# EAGLE schematic bat_mini5 (EAGLE 9.0.1)
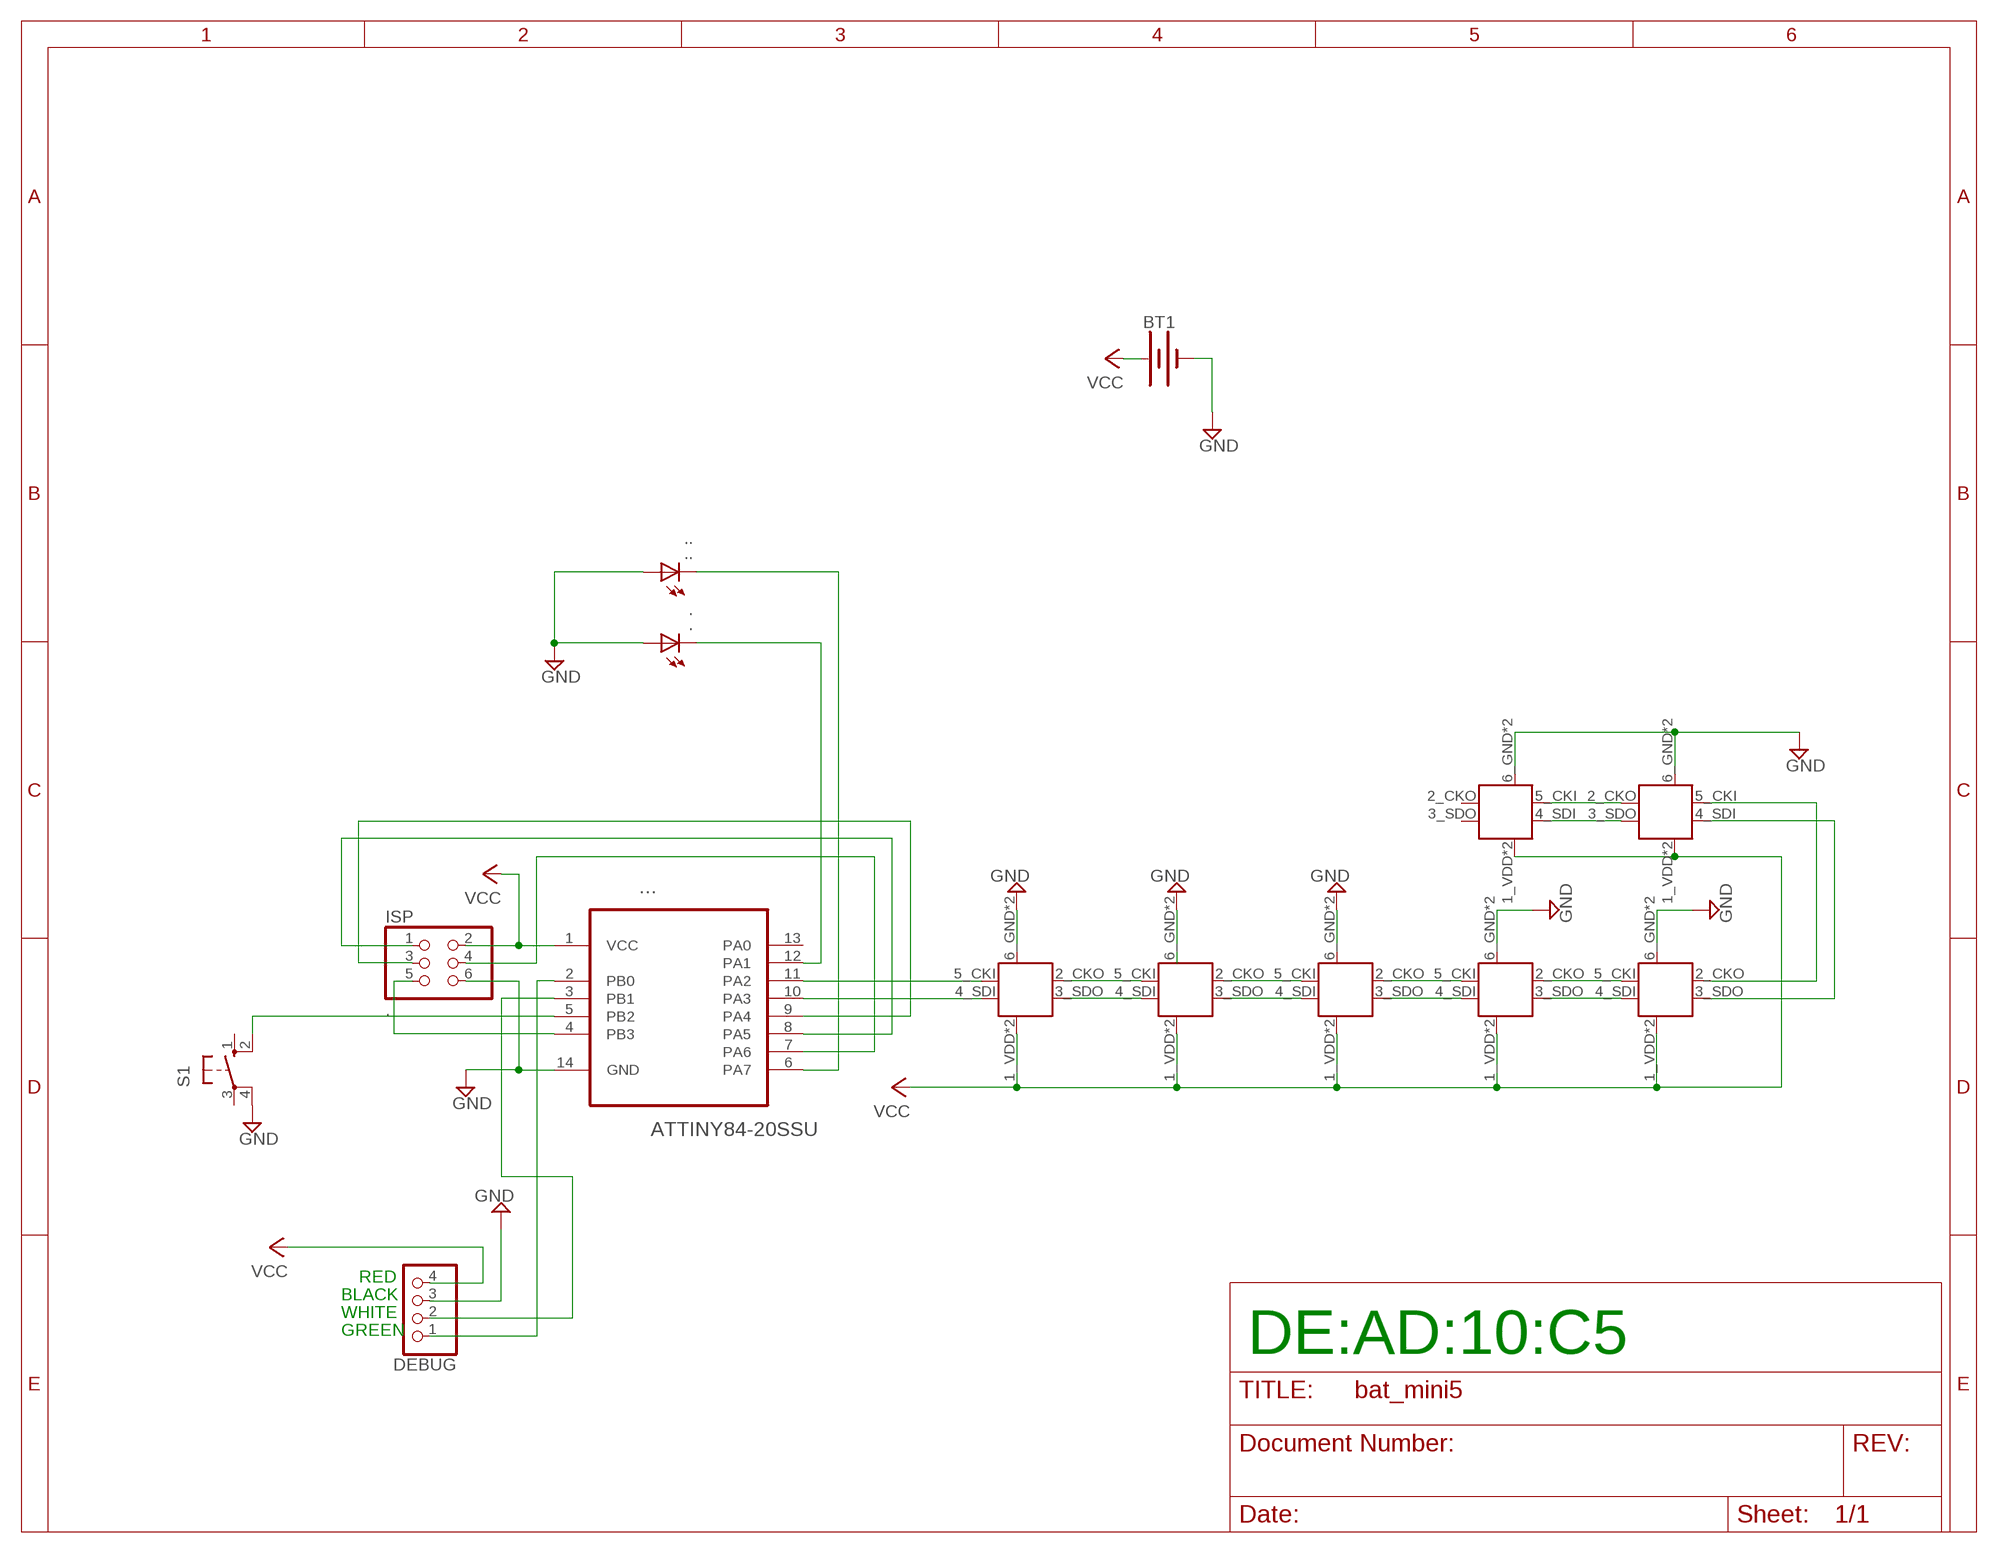
[diagram p0: schematic, sheet 1]

## Parts
.  .  LEDCHIP-LED0805  [CHIP-LED0805]
..  ..  LEDCHIP-LED0805  [CHIP-LED0805]
...  ATTINY84-20SSU  [SOIC127P600X175-14N]
BT1  BATTERY-20MM_SMD_4LEGS  [BATTCON_20MM_4LEGS]
DEBUG  PINHD-1X4  [1X04]
ISP  .  PINHD-2X3  [2X03]
ONE  APA102  [APA102-2020]
S1  10-XX  [B3F-10XX]
THREE  APA102  [APA102-2020]
TWO  APA102  [APA102-2020]
U$5  APA102  [APA102-2020]
U$6  APA102  [APA102-2020]
U$7  APA102  [APA102-2020]
U$8  APA102  [APA102-2020]

## Nets
GND: ....14(GND) ...A ..A BT1.NEGATIVE(-) DEBUG.3 ISP.6 ONE.6_GND(GND) ONE.GNDPAD(GND) S1.4(P1) U$5.6_GND(GND) U$5.GNDPAD(GND) U$6.6_GND(GND) U$6.GNDPAD(GND) U$8.6_GND(GND) U$8.GNDPAD(GND)
N$1: ....2(PB0) DEBUG.1
N$3: ....8(PA5) ISP.1
N$4: ....7(PA6) ISP.4
N$5: ....9(PA4) ISP.3
N$6: ....4(PB3) ISP.5
N$7: ....12(PA1) ..C
N$8: ....6(PA7) ...C
N$9: ....11(PA2) ONE.5_CKI(CKI)
N$10: ....10(PA3) ONE.4_SDI(SDI)
N$11: ONE.3_SDO(SDO) TWO.4_SDI(SDI)
N$12: ONE.2_CKO(CKO) TWO.5_CKI(CKI)
N$13: THREE.4_SDI(SDI) TWO.3_SDO(SDO)
N$14: THREE.5_CKI(CKI) TWO.2_CKO(CKO)
N$15: ....3(PB1) DEBUG.2
N$16: THREE.3_SDO(SDO) U$5.4_SDI(SDI)
N$17: THREE.2_CKO(CKO) U$5.5_CKI(CKI)
N$18: U$5.3_SDO(SDO) U$6.4_SDI(SDI)
N$19: U$5.2_CKO(CKO) U$6.5_CKI(CKI)
N$20: U$6.2_CKO(CKO) U$7.5_CKI(CKI)
N$21: U$6.3_SDO(SDO) U$7.4_SDI(SDI)
N$22: U$7.3_SDO(SDO) U$8.4_SDI(SDI)
N$23: U$7.2_CKO(CKO) U$8.5_CKI(CKI)
N$24: ....5(PB2) S1.2(S1)
VCC: ....1(VCC) BT1.POSITIVE@1(+) BT1.POSITIVE@2(+) BT1.POSITIVE@3(+) BT1.POSITIVE@4(+) DEBUG.4 ISP.2 ONE.1_VDD(VCC) ONE.VDDPAD(VCC) THREE.1_VDD(VCC) THREE.VDDPAD(VCC) TWO.1_VDD(VCC) TWO.VDDPAD(VCC) U$5.1_VDD(VCC) U$5.VDDPAD(VCC) U$6.1_VDD(VCC) U$6.VDDPAD(VCC) U$7.1_VDD(VCC) U$7.VDDPAD(VCC) U$8.1_VDD(VCC) U$8.VDDPAD(VCC)
Unconnected: ....13(PA0) S1.1(S) S1.3(P) U$8.2_CKO(CKO) U$8.3_SDO(SDO)

## Notes on the sheet
- RED
- BLACK
- WHITE
- GREEN
- DE:AD:10:C5

## Power pins joined to a net without a drawn wire
GND: THREE.6_GND(GND) THREE.GNDPAD(GND) TWO.6_GND(GND) TWO.GNDPAD(GND) U$7.6_GND(GND) U$7.GNDPAD(GND)

## Library data of the parts
. .. = led:LED: LED OSRAM: - CHIPLED LG R971, LG N971, LY N971, LG Q971, LY Q971, LO R971, LY R971 LH N974, LH R974 LS Q976, LO Q976, LY Q976 LO Q996 - Hyper CHIPLED LW Q18S LB Q993, LB Q99A, LB R99A - SideLED LS A670, LO A670, LY A670, LG A670, LP A670 LB A673, LV A673, LT A673, LW A673 LH A674 LY A675 LS A676, LA A676, LO A676, LY A676, LW A676 LS A679, LY A679, LG A679 - Hyper Micro SIDELED® LS Y876, LA Y876, LO Y876, LY Y876 LT Y87S - SmartLED LW L88C, LW L88S LB L89C, LB L89S, LG L890 LS L89K, LO L89K, LY L89K LS L896, LA L896, LO L896, LY L896 - TOPLED LS T670, LO T670, LY T670, LG T670, LP T670 LSG T670, LSP T670, LSY T670, LOP T670, LYG T670 LG T671, LOG T671, LSG T671 LB T673, LV T673, LT T673, LW T673 LH T674 LS T676, LA T676, LO T676, LY T676, LB T676, LH T676, LSB T676, LW T676 LB T67C, LV T67C, LT T67C, LS T67K, LO T67K, LY T67K, LW E67C LS E67B, LA E67B, LO E67B, LY E67B, LB E67C, LV E67C, LT E67C LW T67C LS T679, LY T679, LG T679 LS T770, LO T770, LY T770, LG T770, LP T770 LB T773, LV T773, LT T773, LW T773 LH T774 LS E675, LA E675, LY E675, LS T675 LS T776, LA T776, LO T776, LY T776, LB T776 LHGB T686 LT T68C, LB T68C - Hyper Mini TOPLED® LB M676 - Mini TOPLED Santana® LG M470 LS M47K, LO M47K, LY M47K Source: http://www.osram.convergy.de LUXEON: - LUMILED® LXK2-PW12-R00, LXK2-PW12-S00, LXK2-PW14-U00, LXK2-PW14-V00 LXK2-PM12-R00, LXK2-PM12-S00, LXK2-PM14-U00 LXK2-PE12-Q00, LXK2-PE12-R00, LXK2-PE12-S00, LXK2-PE14-T00, LXK2-PE14-U00 LXK2-PB12-K00, LXK2-PB12-L00, LXK2-PB12-M00, LXK2-PB14-N00, LXK2-PB14-P00, LXK2-PB14-Q00 LXK2-PR12-L00, LXK2-PR12-M00, LXK2-PR14-Q00, LXK2-PR14-R00 LXK2-PD12-Q00, LXK2-PD12-R00, LXK2-PD12-S00 LXK2-PH12-R00, LXK2-PH12-S00 LXK2-PL12-P00, LXK2-PL12-Q00, LXK2-PL12-R00 Source: www.luxeon.com KINGBRIGHT: KA-3528ASYC Source: www.kingbright.com
... = Atmel_By_element14_Batch_1-00:ATTINY84-20SSU: 8-bit Microcontroller with Bytes In-System Programmable Flash; OC_FARNELL: 1636955; OC_NEWARK: 03P2040; PACKAGE: SOIC-14; SUPPLIER: Atmel
BT1 = SF_Batteries:BATTERY: Battery - Single Cell A variety of battery chemistries, sizes, and footprints. Device List: 20MM_PTH - Coin Cell Battery Holder - 20mm (PTH) <https://www.sparkfun.com/products/783> 12MM_SMD - Coin Cell Battery Holder - 12mm (SMD) <https://www.sparkfun.com/products/10592> 12MM_PTH - Coin Cell Battery Holder - 12mm (PTH) <https://www.sparkfun.com/products/7948> 20MM_SMD - 20mm Coin Cell Battery Holder (SMD) (2 legs) Used on the Big Time Watch Kit <https://www.sparkfun.com/products/11734> 20MM_SMD_4LEGS - Coin Cell Battery Holder - 20mm (SMD) <https://www.sparkfun.com/products/11892> 20MM_SMD_4LEGS_OVERPASTE - Coin Cell Battery Holder - 20mm (SMD) <https://www.sparkfun.com/products/11892> (Over-paste on the legs) 24.5MM_PTH - Coin Cell Battery Holder - 24.5mm (PTH) <https://www.sparkfun.com/products/8863> 9V - 9V Battery Holder - PC Mount Used on the SparkFun SparkPunk Sound Kit <https://www.sparkfun.com/products/11177> and SparkFun SparkPunk Sequencer Kit <https://www.sparkfun.com/products/12707> 18650 - Battery Holder - 18650 (PTH) <https://www.sparkfun.com/products/13113> AA - Battery Holder - 1xAA (PTH) <https://www.sparkfun.com/products/7949> AAA - Battery Holder - 1xAAA (PTH) <https://www.sparkfun.com/products/12718> AA_KIT - Battery Holder - 1xAA (PTH) <https://www.sparkfun.com/products/7949> Special kit package - pads only have exposed copper on one side of the board. AAA_KIT - Battery Holder - 1xAAA (PTH) <https://www.sparkfun.com/products/12718> Special kit package - pads only have exposed copper on one side of the board.; PROD_ID: BATT-10373; SF_SKU: PRT-11892
DEBUG = pinhead:PINHD-1X4: PIN HEADER
ISP = pinhead:PINHD-2X3: PIN HEADER
ONE THREE TWO U$5-U$8 = pimoroni-optoelectronics:APA102
S1 = switch-omron:10-XX: OMRON SWITCH; MPN: B3F-1000; OC_FARNELL: 176432; OC_NEWARK: 36M3542